# EAGLE design test-board (EAGLE 5.11)
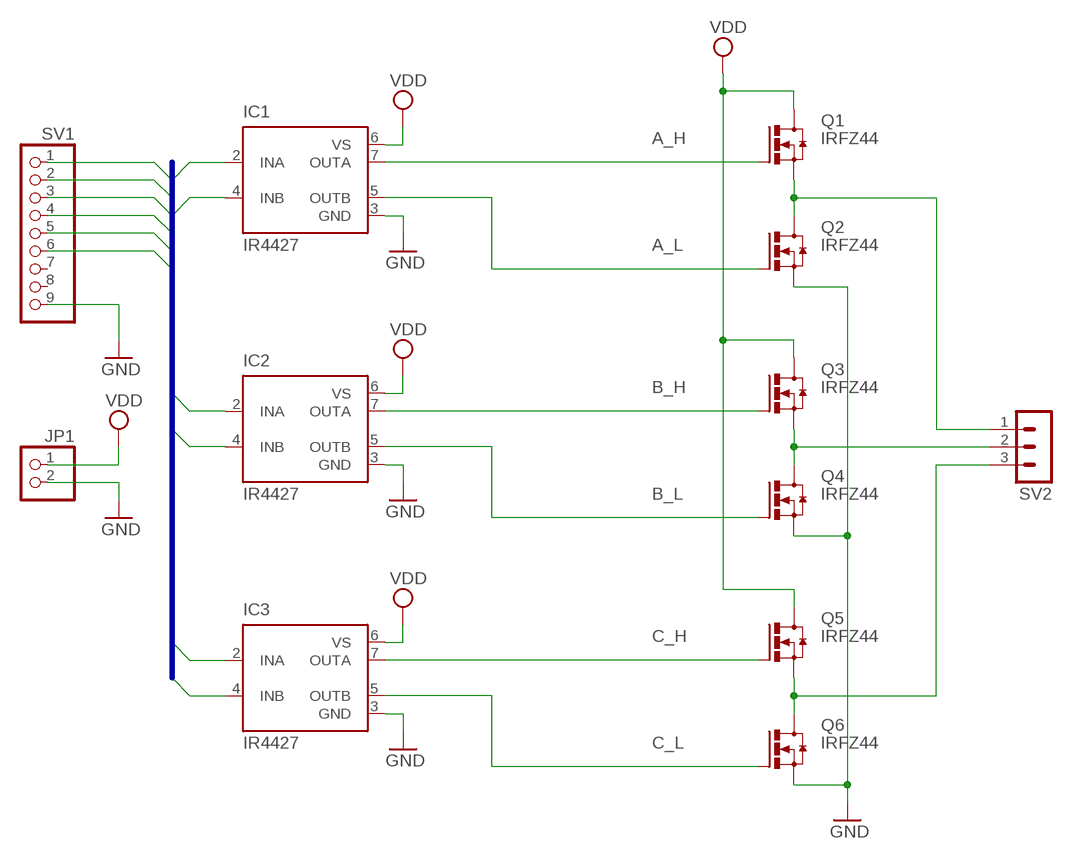
[diagram p0: schematic, sheet 1]

## Parts
IC1  IR4427  [DIL08]
IC2  IR4427  [DIL08]
IC3  IR4427  [DIL08]
JP1  PINHD-1X2  [1X02]
Q1  IRFZ44  [TO220BV]
Q2  IRFZ44  [TO220BV]
Q3  IRFZ44  [TO220BV]
Q4  IRFZ44  [TO220BV]
Q5  IRFZ44  [TO220BV]
Q6  IRFZ44  [TO220BV]
SV1  PINHD-1X9  [1X09]
SV2  MA03-1  [MA03-1]

## Nets
A: Q1.3(S) Q2.2(D) SV2.1
A_H: IC1.7(OUTA) Q1.1(G)
A_L: IC1.5(OUTB) Q2.1(G)
B: Q3.3(S) Q4.2(D) SV2.2
B_H: IC2.7(OUTA) Q3.1(G)
B_L: IC2.5(OUTB) Q4.1(G)
C: Q5.3(S) Q6.2(D) SV2.3
C_H: IC3.7(OUTA) Q5.1(G)
C_L: IC3.5(OUTB) Q6.1(G)
GND: IC1.3(GND) IC2.3(GND) IC3.3(GND) JP1.2 Q2.3(S) Q4.3(S) Q6.3(S) SV1.9
INPUT_A_H: IC1.2(INA) SV1.2
INPUT_A_L: IC1.4(INB) SV1.1
INPUT_B_H: IC2.2(INA) SV1.4
INPUT_B_L: IC2.4(INB) SV1.3
INPUT_C_H: IC3.2(INA) SV1.6
INPUT_C_L: IC3.4(INB) SV1.5
VDD: IC1.6(VS) IC2.6(VS) IC3.6(VS) JP1.1 Q1.2(D) Q3.2(D) Q5.2(D)
Unconnected: SV1.7 SV1.8

## Buses
INPUT_A_H,INPUT_A_L,INPUT_B_H,INPUT_B_L,INPUT_C_H,INPUT_C_L

## Library data of the parts
IC1-IC3 = ir:IR4427: DUAL LOW SIDE DRIVER Source: ID4426.pdf; MF: INTERNATIONAL RECTIFIER(IR); MPN: IR4427; OC_FARNELL: 1023267; OC_NEWARK: 27C6914
JP1 = pinhead:PINHD-1X2: PIN HEADER
Q1-Q6 = irf:IRFZ44: 50A, 60V, N-Channel Power MOSFET
SV1 = pinhead:PINHD-1X9: PIN HEADER
SV2 = con-lstb:MA03-1: PIN HEADER; OC_FARNELL: unknown; OC_NEWARK: unknown

## Board
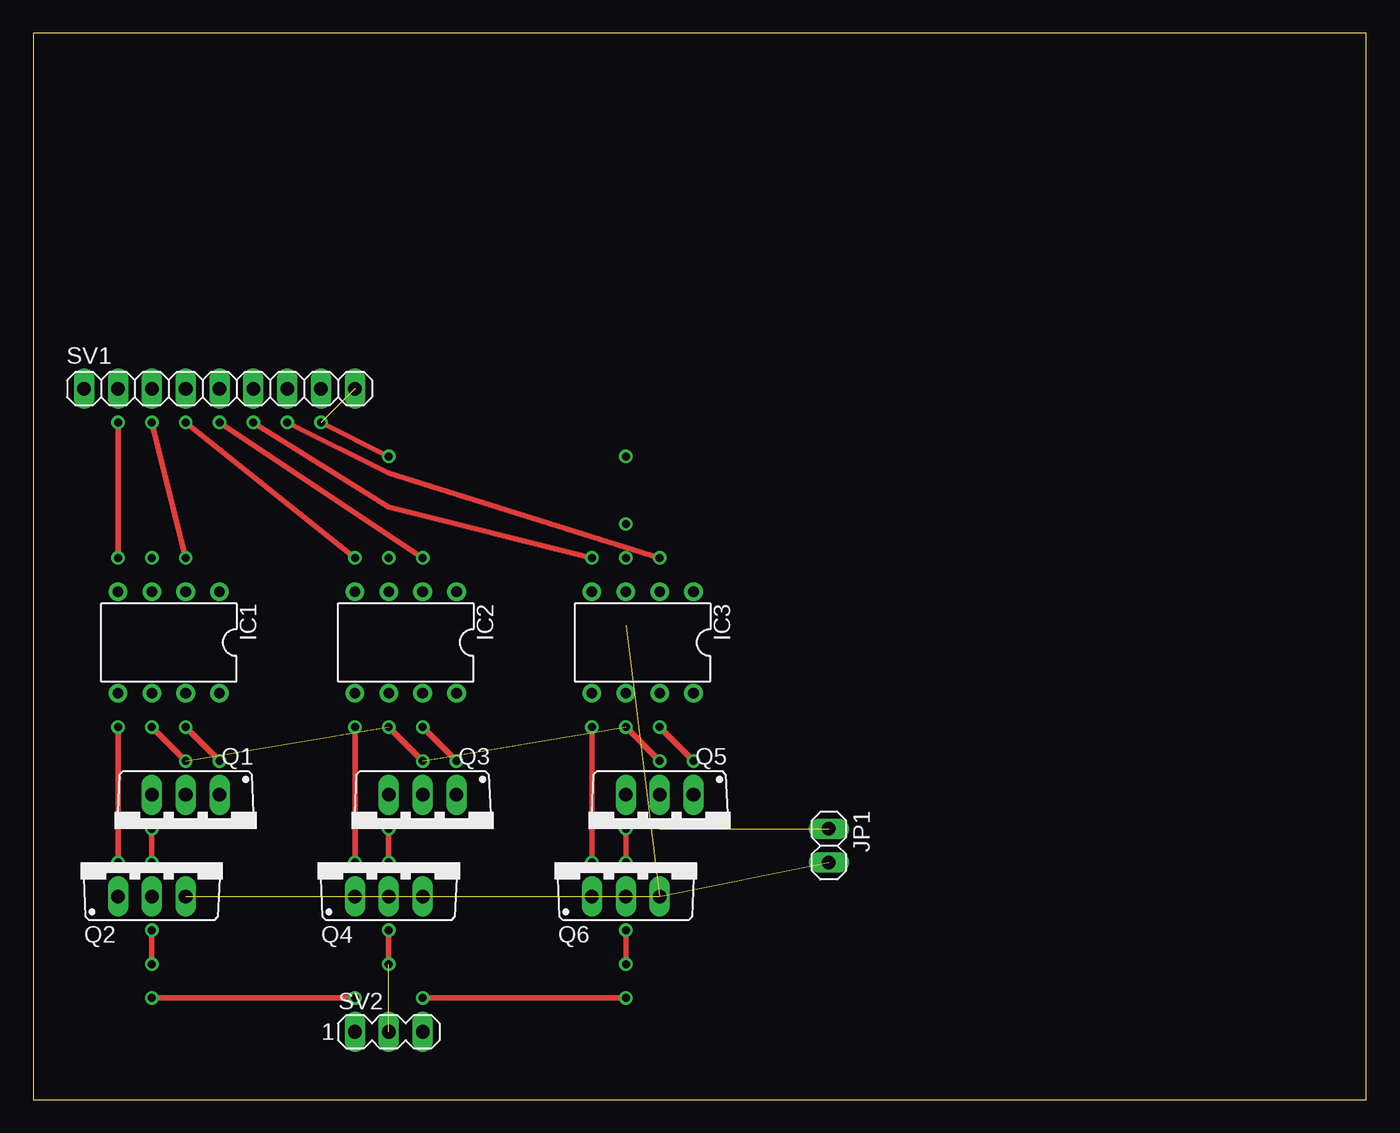
[diagram p1: board, top side]
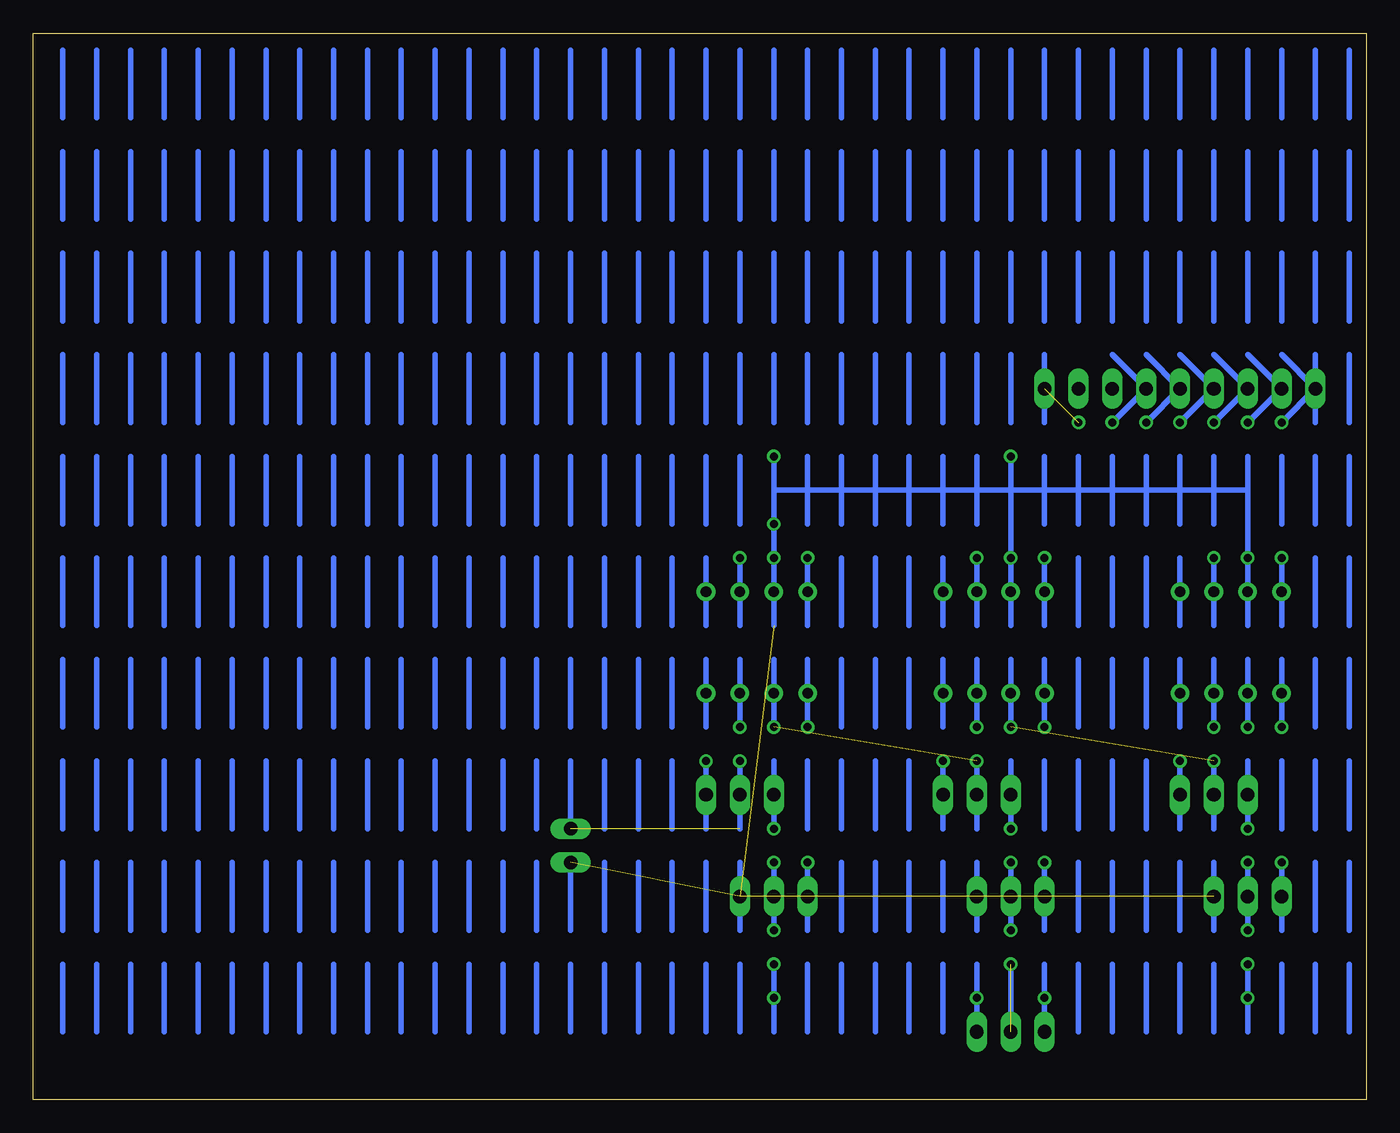
[diagram p2: board, bottom side, seen from below]

Size 100 x 80 mm. Coordinates in mm from the lower left corner, seen from the top.
Outline: 0,0 100,0 100,80 0,80 0,0
Copper layers (1*16): Top 0.035mm / dielectric 1.5mm / Bottom 0.035mm
Design rules "default": minimum track width 10mil, minimum drill 0.6mm, track to track 8mil, track to pad 8mil, pad to pad 8mil, via to via 8mil, smd to smd 8mil, copper to edge 40mil, drill to drill 8mil, minimum pad ring 10mil, minimum via ring 8mil, stop-mask expansion 4mil, vias tented up to drill 0mil, thermal gap 10mil

### Footprints (pad centres in the part's own frame; a part is rotated, then mirrored left to right if it is on the bottom)
DIL08 = drill 0.8 pad 1.4 round: 1 -3.81,-3.81; 2 -1.27,-3.81; 3 1.27,-3.81; 4 3.81,-3.81; 5 3.81,3.81; 6 1.27,3.81; 7 -1.27,3.81; 8 -3.81,3.81
1X02 = drill 1.016 long: 1 -1.27,0; 2 1.27,0
TO220BV = drill 1.016 long: 1 -2.54,-2.54; 2 0,-2.54; 3 2.54,-2.54
1X09 = drill 1.016 long: 1 -10.16,0; 2 -7.62,0; 3 -5.08,0; 4 -2.54,0; 5 0,0; 6 2.54,0; 7 5.08,0; 8 7.62,0; 9 10.16,0
MA03-1 = drill 1.016 long: 1 -2.54,0; 2 0,0; 3 2.54,0

### Placement (x,y rotation side)
IC1  10.16,34.29 180 top
IC2  27.94,34.29 180 top
IC3  45.72,34.29 180 top
JP1  59.69,19.05 270 top
Q1  11.43,20.32 180 top
Q2  8.89,17.78 0 top
Q3  29.21,20.32 180 top
Q4  26.67,17.78 0 top
Q5  46.99,20.32 180 top
Q6  44.45,17.78 0 top
SV1  13.97,53.34 0 top
SV2  26.67,5.08 0 top

### Tracks (layer width: path | path; a pad name or v marks a point on that pad's centre or on a via)
A  (via drill 0.6)
  Top 0.406: v8.89,17.78 v8.89,20.32 | v8.89,10.16 v8.89,12.7 | v8.89,7.62 v24.13,7.62
  Bottom 0.406: v8.89,20.32 Q1.3 8.89,25.4 | v8.89,12.7 Q2.2 v8.89,17.78 | 8.89,5.08 v8.89,7.62 v8.89,10.16 | SV2.1 v24.13,7.62 24.13,10.16
  other vias: 8.89,22.86 8.89,15.24
A_H  (via drill 0.6)
  Top 0.406: v13.97,25.4 v11.43,27.94
  Bottom 0.406: v11.43,27.94 IC1.7 11.43,33.02 | 13.97,20.32 Q1.1 v13.97,25.4
  other vias: 11.43,30.48 13.97,22.86
A_L  (via drill 0.6)
  Top 0.406: v6.35,17.78 v6.35,27.94
  Bottom 0.406: v6.35,27.94 IC1.5 6.35,33.02 | 6.35,12.7 Q2.1 v6.35,17.78
  other vias: 6.35,30.48 6.35,15.24
B  (via drill 0.6)  (1 unrouted)
  Top 0.406: 26.67,10.16 v26.67,12.7 | v26.67,17.78 v26.67,20.32
  Bottom 0.406: v26.67,17.78 Q4.2 v26.67,12.7 | v26.67,20.32 Q3.3 26.67,25.4
  other vias: 26.67,15.24 26.67,22.86
B_H  (via drill 0.6)
  Top 0.406: v31.75,25.4 v29.21,27.94
  Bottom 0.406: v29.21,27.94 IC2.7 29.21,33.02 | 31.75,20.32 Q3.1 v31.75,25.4
  other vias: 29.21,30.48 31.75,22.86
B_L  (via drill 0.6)
  Top 0.406: v24.13,17.78 v24.13,27.94
  Bottom 0.406: v24.13,27.94 IC2.5 24.13,33.02 | 24.13,12.7 Q4.1 v24.13,17.78
  other vias: 24.13,30.48 24.13,15.24
C  (via drill 0.6)
  Top 0.406: v44.45,17.78 v44.45,20.32 | v29.21,7.62 v44.45,7.62 | v44.45,10.16 v44.45,12.7
  Bottom 0.406: v44.45,20.32 Q5.3 44.45,25.4 | v44.45,12.7 Q6.2 v44.45,17.78 | SV2.3 v29.21,7.62 29.21,10.16 | 44.45,5.08 v44.45,7.62 v44.45,10.16
  other vias: 44.45,22.86 44.45,15.24
C_H  (via drill 0.6)
  Top 0.406: v49.53,25.4 v46.99,27.94
  Bottom 0.406: v46.99,27.94 IC3.7 46.99,33.02 | 49.53,20.32 Q5.1 v49.53,25.4
  other vias: 49.53,22.86 46.99,30.48
C_L  (via drill 0.6)
  Top 0.406: v41.91,17.78 v41.91,27.94
  Bottom 0.406: v41.91,27.94 IC3.5 41.91,33.02 | 41.91,12.7 Q6.1 v41.91,17.78
  other vias: 41.91,15.24 41.91,30.48
GND  (via drill 0.6)  (5 unrouted)
  Top 0.406: v26.67,48.26 v21.59,50.8
  Bottom 0.406: 8.89,35.56 IC1.3 v8.89,40.64 8.89,45.72 | 26.67,35.56 IC2.3 v26.67,40.64 26.67,45.72 | 44.45,35.56 IC3.3 v44.45,40.64 v44.45,43.18 44.45,45.72 | 26.67,45.72 v26.67,48.26 | 44.45,45.72 v44.45,48.26 | 8.89,45.72 8.89,48.26 | 8.89,45.72 11.43,45.72 | 11.43,45.72 13.97,45.72 | 13.97,45.72 16.51,45.72 | 16.51,45.72 19.05,45.72 | 19.05,45.72 21.59,45.72 | 21.59,45.72 24.13,45.72 | 24.13,45.72 26.67,45.72 | 11.43,45.72 11.43,48.26 | 13.97,45.72 13.97,48.26 | 16.51,45.72 16.51,48.26 | 19.05,45.72 19.05,48.26 | 21.59,45.72 21.59,48.26 | 24.13,45.72 24.13,48.26 | 24.13,45.72 24.13,43.18 | 21.59,45.72 21.59,43.18 | 19.05,45.72 19.05,43.18 | 16.51,45.72 16.51,43.18 | 13.97,45.72 13.97,43.18 | 11.43,45.72 11.43,43.18 | 29.21,45.72 29.21,43.18 | 29.21,45.72 29.21,48.26 | 26.67,45.72 29.21,45.72 | 31.75,45.72 31.75,43.18 | 31.75,45.72 31.75,48.26 | 29.21,45.72 31.75,45.72 | 34.29,45.72 34.29,43.18 | 34.29,45.72 34.29,48.26 | 31.75,45.72 34.29,45.72 | 36.83,45.72 36.83,43.18 | 36.83,45.72 36.83,48.26 | 34.29,45.72 36.83,45.72 | 39.37,45.72 39.37,43.18 | 39.37,45.72 39.37,48.26 | 36.83,45.72 39.37,45.72 | 41.91,45.72 41.91,43.18 | 41.91,45.72 41.91,48.26 | 39.37,45.72 41.91,45.72 | 41.91,45.72 44.45,45.72
  other vias: 8.89,38.1 26.67,38.1 44.45,38.1
INPUT_A_H  (via drill 0.6)
  Top 0.406: v11.43,40.64 v8.89,50.8
  Bottom 0.406: 11.43,35.56 IC1.2 v11.43,40.64 | v8.89,50.8 SV1.2 8.89,55.88
  other vias: 11.43,38.1 6.35,53.34
INPUT_A_L  (via drill 0.6)
  Top 0.406: v6.35,40.64 v6.35,50.8
  Bottom 0.406: 6.35,35.56 IC1.4 v6.35,40.64 | v6.35,50.8 SV1.1 6.35,55.88
  other vias: 6.35,38.1 3.81,53.34 3.81,53.34 3.81,53.34
INPUT_B_H  (via drill 0.6)
  Top 0.406: v13.97,50.8 v29.21,40.64
  Bottom 0.406: 29.21,35.56 IC2.2 v29.21,40.64 | v13.97,50.8 SV1.4 13.97,55.88
  other vias: 29.21,38.1 11.43,53.34
INPUT_B_L  (via drill 0.6)
  Top 0.406: v24.13,40.64 v11.43,50.8
  Bottom 0.406: 24.13,35.56 IC2.4 v24.13,40.64 | v11.43,50.8 SV1.3 11.43,55.88
  other vias: 24.13,38.1 8.89,53.34
INPUT_C_H  (via drill 0.6)
  Top 0.406: v19.05,50.8 26.67,46.99 v46.99,40.64
  Bottom 0.406: 46.99,35.56 IC3.2 v46.99,40.64 | v19.05,50.8 SV1.6 19.05,55.88
  other vias: 46.99,38.1 16.51,53.34
INPUT_C_L  (via drill 0.6)
  Top 0.406: v16.51,50.8 26.67,44.45 v41.91,40.64
  Bottom 0.406: 41.91,35.56 IC3.4 v41.91,40.64 | v16.51,50.8 SV1.5 16.51,55.88
  other vias: 41.91,38.1 13.97,53.34
N$1
  Bottom 0.406: 24.13,20.32 24.13,25.4
N$2
  Bottom 0.406: 1.27,73.66 1.27,78.74
N$3
  Bottom 0.406: 3.81,73.66 3.81,78.74
N$4
  Bottom 0.406: 6.35,43.18 6.35,48.26
N$5
  Bottom 0.406: 6.35,73.66 6.35,78.74
N$6
  Bottom 0.406: 8.89,73.66 8.89,78.74
N$7
  Bottom 0.406: 11.43,73.66 11.43,78.74
N$8
  Bottom 0.406: 13.97,73.66 13.97,78.74
N$10
  Bottom 0.406: 16.51,73.66 16.51,78.74
N$11
  Bottom 0.406: 19.05,73.66 19.05,78.74
N$12
  Bottom 0.406: 21.59,73.66 21.59,78.74
N$13
  Bottom 0.406: 24.13,73.66 24.13,78.74
N$14
  Bottom 0.406: 26.67,73.66 26.67,78.74
N$15
  Bottom 0.406: 29.21,73.66 29.21,78.74
N$16
  Bottom 0.406: 31.75,73.66 31.75,78.74
N$17
  Bottom 0.406: 34.29,73.66 34.29,78.74
N$18
  Bottom 0.406: 36.83,73.66 36.83,78.74
N$19
  Bottom 0.406: 39.37,73.66 39.37,78.74
N$20
  Bottom 0.406: 41.91,73.66 41.91,78.74
N$21
  Bottom 0.406: 44.45,73.66 44.45,78.74
N$22
  Bottom 0.406: 46.99,73.66 46.99,78.74
N$23
  Bottom 0.406: 49.53,73.66 49.53,78.74
N$24
  Bottom 0.406: 52.07,73.66 52.07,78.74
N$25
  Bottom 0.406: 54.61,73.66 54.61,78.74
N$26
  Bottom 0.406: 57.15,73.66 57.15,78.74
N$27
  Bottom 0.406: 59.69,73.66 59.69,78.74
N$28
  Bottom 0.406: 62.23,73.66 62.23,78.74
N$29
  Bottom 0.406: 64.77,73.66 64.77,78.74
N$30
  Bottom 0.406: 67.31,73.66 67.31,78.74
N$31
  Bottom 0.406: 69.85,73.66 69.85,78.74
N$32
  Bottom 0.406: 72.39,73.66 72.39,78.74
N$33
  Bottom 0.406: 74.93,73.66 74.93,78.74
N$34
  Bottom 0.406: 77.47,73.66 77.47,78.74
N$35
  Bottom 0.406: 80.01,73.66 80.01,78.74
N$36
  Bottom 0.406: 82.55,73.66 82.55,78.74
N$37
  Bottom 0.406: 85.09,73.66 85.09,78.74
N$38
  Bottom 0.406: 87.63,73.66 87.63,78.74
N$39
  Bottom 0.406: 90.17,73.66 90.17,78.74
N$40
  Bottom 0.406: 92.71,73.66 92.71,78.74
N$41
  Bottom 0.406: 95.25,73.66 95.25,78.74
N$42
  Bottom 0.406: 97.79,73.66 97.79,78.74
N$43
  Bottom 0.406: 1.27,66.04 1.27,71.12
N$44
  Bottom 0.406: 3.81,66.04 3.81,71.12
N$45
  Bottom 0.406: 6.35,66.04 6.35,71.12
N$46
  Bottom 0.406: 8.89,66.04 8.89,71.12
N$47
  Bottom 0.406: 11.43,66.04 11.43,71.12
N$48
  Bottom 0.406: 13.97,66.04 13.97,71.12
N$49
  Bottom 0.406: 16.51,66.04 16.51,71.12
N$50
  Bottom 0.406: 19.05,66.04 19.05,71.12
N$51
  Bottom 0.406: 21.59,66.04 21.59,71.12
N$52
  Bottom 0.406: 24.13,66.04 24.13,71.12
N$53
  Bottom 0.406: 26.67,66.04 26.67,71.12
N$54
  Bottom 0.406: 29.21,66.04 29.21,71.12
N$55
  Bottom 0.406: 31.75,66.04 31.75,71.12
N$56
  Bottom 0.406: 34.29,66.04 34.29,71.12
N$57
  Bottom 0.406: 36.83,66.04 36.83,71.12
N$58
  Bottom 0.406: 39.37,66.04 39.37,71.12
N$59
  Bottom 0.406: 41.91,66.04 41.91,71.12
N$60
  Bottom 0.406: 44.45,66.04 44.45,71.12
N$61
  Bottom 0.406: 46.99,66.04 46.99,71.12
N$62
  Bottom 0.406: 49.53,66.04 49.53,71.12
N$63
  Bottom 0.406: 52.07,66.04 52.07,71.12
N$64
  Bottom 0.406: 54.61,66.04 54.61,71.12
N$65
  Bottom 0.406: 57.15,66.04 57.15,71.12
N$66
  Bottom 0.406: 59.69,66.04 59.69,71.12
N$67
  Bottom 0.406: 62.23,66.04 62.23,71.12
N$68
  Bottom 0.406: 64.77,66.04 64.77,71.12
N$69
  Bottom 0.406: 67.31,66.04 67.31,71.12
N$70
  Bottom 0.406: 69.85,66.04 69.85,71.12
N$71
  Bottom 0.406: 72.39,66.04 72.39,71.12
N$72
  Bottom 0.406: 74.93,66.04 74.93,71.12
N$73
  Bottom 0.406: 77.47,66.04 77.47,71.12
N$74
  Bottom 0.406: 80.01,66.04 80.01,71.12
N$75
  Bottom 0.406: 82.55,66.04 82.55,71.12
N$76
  Bottom 0.406: 85.09,66.04 85.09,71.12
N$77
  Bottom 0.406: 87.63,66.04 87.63,71.12
N$78
  Bottom 0.406: 90.17,66.04 90.17,71.12
N$79
  Bottom 0.406: 92.71,66.04 92.71,71.12
N$80
  Bottom 0.406: 95.25,66.04 95.25,71.12
N$81
  Bottom 0.406: 97.79,66.04 97.79,71.12
N$82
  Bottom 0.406: 1.27,58.42 1.27,63.5
N$83
  Bottom 0.406: 3.81,58.42 3.81,63.5
N$84
  Bottom 0.406: 6.35,58.42 6.35,63.5
N$85
  Bottom 0.406: 8.89,58.42 8.89,63.5
N$86
  Bottom 0.406: 11.43,58.42 11.43,63.5
N$87
  Bottom 0.406: 13.97,58.42 13.97,63.5
N$88
  Bottom 0.406: 16.51,58.42 16.51,63.5
N$89
  Bottom 0.406: 19.05,58.42 19.05,63.5
N$90
  Bottom 0.406: 21.59,58.42 21.59,63.5
N$91
  Bottom 0.406: 24.13,58.42 24.13,63.5
N$92
  Bottom 0.406: 26.67,58.42 26.67,63.5
N$93
  Bottom 0.406: 29.21,58.42 29.21,63.5
N$94
  Bottom 0.406: 31.75,58.42 31.75,63.5
N$95
  Bottom 0.406: 34.29,58.42 34.29,63.5
N$96
  Bottom 0.406: 36.83,58.42 36.83,63.5
N$97
  Bottom 0.406: 39.37,58.42 39.37,63.5
N$98
  Bottom 0.406: 41.91,58.42 41.91,63.5
N$99
  Bottom 0.406: 44.45,58.42 44.45,63.5
N$100
  Bottom 0.406: 46.99,58.42 46.99,63.5
N$101
  Bottom 0.406: 49.53,58.42 49.53,63.5
N$102
  Bottom 0.406: 52.07,58.42 52.07,63.5
N$103
  Bottom 0.406: 54.61,58.42 54.61,63.5
N$104
  Bottom 0.406: 57.15,58.42 57.15,63.5
N$105
  Bottom 0.406: 59.69,58.42 59.69,63.5
N$106
  Bottom 0.406: 62.23,58.42 62.23,63.5
N$107
  Bottom 0.406: 64.77,58.42 64.77,63.5
N$108
  Bottom 0.406: 67.31,58.42 67.31,63.5
N$109
  Bottom 0.406: 69.85,58.42 69.85,63.5
N$110
  Bottom 0.406: 72.39,58.42 72.39,63.5
N$111
  Bottom 0.406: 74.93,58.42 74.93,63.5
N$112
  Bottom 0.406: 77.47,58.42 77.47,63.5
N$113
  Bottom 0.406: 80.01,58.42 80.01,63.5
N$114
  Bottom 0.406: 82.55,58.42 82.55,63.5
N$115
  Bottom 0.406: 85.09,58.42 85.09,63.5
N$116
  Bottom 0.406: 87.63,58.42 87.63,63.5
N$117
  Bottom 0.406: 90.17,58.42 90.17,63.5
N$118
  Bottom 0.406: 92.71,58.42 92.71,63.5
N$119
  Bottom 0.406: 95.25,58.42 95.25,63.5
N$120
  Bottom 0.406: 97.79,58.42 97.79,63.5
N$121
  Bottom 0.406: 1.27,50.8 1.27,55.88
N$122
  Bottom 0.406: 3.81,50.8 3.81,55.88
N$130
  Bottom 0.406: 24.13,50.8 24.13,55.88
N$131
  Bottom 0.406: 26.67,50.8 26.67,55.88
N$132
  Bottom 0.406: 29.21,50.8 29.21,55.88
N$133
  Bottom 0.406: 31.75,50.8 31.75,55.88
N$134
  Bottom 0.406: 34.29,50.8 34.29,55.88
N$135
  Bottom 0.406: 36.83,50.8 36.83,55.88
N$136
  Bottom 0.406: 39.37,50.8 39.37,55.88
N$137
  Bottom 0.406: 41.91,50.8 41.91,55.88
N$138
  Bottom 0.406: 44.45,50.8 44.45,55.88
N$139
  Bottom 0.406: 46.99,50.8 46.99,55.88
N$140
  Bottom 0.406: 49.53,50.8 49.53,55.88
N$141
  Bottom 0.406: 52.07,50.8 52.07,55.88
N$142
  Bottom 0.406: 54.61,50.8 54.61,55.88
N$143
  Bottom 0.406: 57.15,50.8 57.15,55.88
N$144
  Bottom 0.406: 59.69,50.8 59.69,55.88
N$145
  Bottom 0.406: 62.23,50.8 62.23,55.88
N$146
  Bottom 0.406: 64.77,50.8 64.77,55.88
N$147
  Bottom 0.406: 67.31,50.8 67.31,55.88
N$148
  Bottom 0.406: 69.85,50.8 69.85,55.88
N$149
  Bottom 0.406: 72.39,50.8 72.39,55.88
N$150
  Bottom 0.406: 74.93,50.8 74.93,55.88
N$151
  Bottom 0.406: 77.47,50.8 77.47,55.88
N$152
  Bottom 0.406: 80.01,50.8 80.01,55.88
N$153
  Bottom 0.406: 82.55,50.8 82.55,55.88
N$154
  Bottom 0.406: 85.09,50.8 85.09,55.88
N$155
  Bottom 0.406: 87.63,50.8 87.63,55.88
N$156
  Bottom 0.406: 90.17,50.8 90.17,55.88
N$157
  Bottom 0.406: 92.71,50.8 92.71,55.88
N$158
  Bottom 0.406: 95.25,50.8 95.25,55.88
N$159
  Bottom 0.406: 97.79,50.8 97.79,55.88
N$160
  Bottom 0.406: 1.27,43.18 1.27,48.26
N$161
  Bottom 0.406: 3.81,43.18 3.81,48.26
N$178
  Bottom 0.406: 46.99,43.18 46.99,48.26
N$179
  Bottom 0.406: 49.53,43.18 49.53,48.26
N$180
  Bottom 0.406: 52.07,43.18 52.07,48.26
N$181
  Bottom 0.406: 54.61,43.18 54.61,48.26
N$182
  Bottom 0.406: 57.15,43.18 57.15,48.26
N$183
  Bottom 0.406: 59.69,43.18 59.69,48.26
N$184
  Bottom 0.406: 62.23,43.18 62.23,48.26
N$185
  Bottom 0.406: 64.77,43.18 64.77,48.26
N$186
  Bottom 0.406: 67.31,43.18 67.31,48.26
N$187
  Bottom 0.406: 69.85,43.18 69.85,48.26
N$188
  Bottom 0.406: 72.39,43.18 72.39,48.26
N$189
  Bottom 0.406: 74.93,43.18 74.93,48.26
N$190
  Bottom 0.406: 77.47,43.18 77.47,48.26
N$191
  Bottom 0.406: 80.01,43.18 80.01,48.26
N$192
  Bottom 0.406: 82.55,43.18 82.55,48.26
N$193
  Bottom 0.406: 85.09,43.18 85.09,48.26
N$194
  Bottom 0.406: 87.63,43.18 87.63,48.26
N$195
  Bottom 0.406: 90.17,43.18 90.17,48.26
N$196
  Bottom 0.406: 92.71,43.18 92.71,48.26
N$197
  Bottom 0.406: 95.25,43.18 95.25,48.26
N$198
  Bottom 0.406: 97.79,43.18 97.79,48.26
N$199
  Bottom 0.406: 1.27,35.56 1.27,40.64
N$200
  Bottom 0.406: 3.81,35.56 3.81,40.64
N$204  (via drill 0.6)
  Bottom 0.406: 13.97,35.56 v13.97,38.1 13.97,40.64
N$205
  Bottom 0.406: 16.51,35.56 16.51,40.64
N$206
  Bottom 0.406: 19.05,35.56 19.05,40.64
N$207
  Bottom 0.406: 21.59,35.56 21.59,40.64
N$211  (via drill 0.6)
  Bottom 0.406: 31.75,35.56 v31.75,38.1 31.75,40.64
N$212
  Bottom 0.406: 34.29,35.56 34.29,40.64
N$213
  Bottom 0.406: 36.83,35.56 36.83,40.64
N$214
  Bottom 0.406: 39.37,35.56 39.37,40.64
N$218  (via drill 0.6)
  Bottom 0.406: 49.53,35.56 v49.53,38.1 49.53,40.64
N$219
  Bottom 0.406: 52.07,35.56 52.07,40.64
N$220
  Bottom 0.406: 54.61,35.56 54.61,40.64
N$221
  Bottom 0.406: 57.15,35.56 57.15,40.64
N$222
  Bottom 0.406: 59.69,35.56 59.69,40.64
N$223
  Bottom 0.406: 62.23,35.56 62.23,40.64
N$224
  Bottom 0.406: 64.77,35.56 64.77,40.64
N$225
  Bottom 0.406: 67.31,35.56 67.31,40.64
N$226
  Bottom 0.406: 69.85,35.56 69.85,40.64
N$227
  Bottom 0.406: 72.39,35.56 72.39,40.64
N$228
  Bottom 0.406: 74.93,35.56 74.93,40.64
N$229
  Bottom 0.406: 77.47,35.56 77.47,40.64
N$230
  Bottom 0.406: 80.01,35.56 80.01,40.64
N$231
  Bottom 0.406: 82.55,35.56 82.55,40.64
N$232
  Bottom 0.406: 85.09,35.56 85.09,40.64
N$233
  Bottom 0.406: 87.63,35.56 87.63,40.64
N$234
  Bottom 0.406: 90.17,35.56 90.17,40.64
N$235
  Bottom 0.406: 92.71,35.56 92.71,40.64
N$236
  Bottom 0.406: 95.25,35.56 95.25,40.64
N$237
  Bottom 0.406: 97.79,35.56 97.79,40.64
N$238
  Bottom 0.406: 1.27,27.94 1.27,33.02
N$239
  Bottom 0.406: 3.81,27.94 3.81,33.02
N$243  (via drill 0.6)
  Bottom 0.406: 13.97,27.94 v13.97,30.48 13.97,33.02
N$244
  Bottom 0.406: 16.51,27.94 16.51,33.02
N$245
  Bottom 0.406: 19.05,27.94 19.05,33.02
N$246
  Bottom 0.406: 21.59,27.94 21.59,33.02
N$250  (via drill 0.6)
  Bottom 0.406: 31.75,27.94 v31.75,30.48 31.75,33.02
N$251
  Bottom 0.406: 34.29,27.94 34.29,33.02
N$252
  Bottom 0.406: 36.83,27.94 36.83,33.02
N$253
  Bottom 0.406: 39.37,27.94 39.37,33.02
N$257  (via drill 0.6)
  Bottom 0.406: 49.53,27.94 v49.53,30.48 49.53,33.02
N$258
  Bottom 0.406: 52.07,27.94 52.07,33.02
N$259
  Bottom 0.406: 54.61,27.94 54.61,33.02
N$260
  Bottom 0.406: 57.15,27.94 57.15,33.02
N$261
  Bottom 0.406: 59.69,27.94 59.69,33.02
N$262
  Bottom 0.406: 62.23,27.94 62.23,33.02
N$263
  Bottom 0.406: 64.77,27.94 64.77,33.02
N$264
  Bottom 0.406: 67.31,27.94 67.31,33.02
N$265
  Bottom 0.406: 69.85,27.94 69.85,33.02
N$266
  Bottom 0.406: 72.39,27.94 72.39,33.02
N$267
  Bottom 0.406: 74.93,27.94 74.93,33.02
N$268
  Bottom 0.406: 77.47,27.94 77.47,33.02
N$269
  Bottom 0.406: 80.01,27.94 80.01,33.02
N$270
  Bottom 0.406: 82.55,27.94 82.55,33.02
N$271
  Bottom 0.406: 85.09,27.94 85.09,33.02
N$272
  Bottom 0.406: 87.63,27.94 87.63,33.02
N$273
  Bottom 0.406: 90.17,27.94 90.17,33.02
N$274
  Bottom 0.406: 92.71,27.94 92.71,33.02
N$275
  Bottom 0.406: 95.25,27.94 95.25,33.02
N$276
  Bottom 0.406: 97.79,27.94 97.79,33.02
N$277
  Bottom 0.406: 1.27,20.32 1.27,25.4
N$278
  Bottom 0.406: 3.81,20.32 3.81,25.4
N$279
  Bottom 0.406: 6.35,20.32 6.35,25.4
N$283
  Bottom 0.406: 16.51,20.32 16.51,25.4
N$284
  Bottom 0.406: 19.05,20.32 19.05,25.4
N$285
  Bottom 0.406: 21.59,20.32 21.59,25.4
N$290
  Bottom 0.406: 34.29,20.32 34.29,25.4
N$291
  Bottom 0.406: 36.83,20.32 36.83,25.4
N$292
  Bottom 0.406: 39.37,20.32 39.37,25.4
N$293
  Bottom 0.406: 41.91,20.32 41.91,25.4
N$297
  Bottom 0.406: 52.07,20.32 52.07,25.4
N$298
  Bottom 0.406: 54.61,20.32 54.61,25.4
N$299
  Bottom 0.406: 57.15,20.32 57.15,25.4
N$300  (via drill 0.6)
  Bottom 0.406: v59.69,20.32 59.69,25.4
N$301
  Bottom 0.406: 62.23,20.32 62.23,25.4
N$302
  Bottom 0.406: 64.77,20.32 64.77,25.4
N$303
  Bottom 0.406: 67.31,20.32 67.31,25.4
N$304
  Bottom 0.406: 69.85,20.32 69.85,25.4
N$305
  Bottom 0.406: 72.39,20.32 72.39,25.4
N$306
  Bottom 0.406: 74.93,20.32 74.93,25.4
N$307
  Bottom 0.406: 77.47,20.32 77.47,25.4
N$308
  Bottom 0.406: 80.01,20.32 80.01,25.4
N$309
  Bottom 0.406: 82.55,20.32 82.55,25.4
N$310
  Bottom 0.406: 85.09,20.32 85.09,25.4
N$311
  Bottom 0.406: 87.63,20.32 87.63,25.4
N$312
  Bottom 0.406: 90.17,20.32 90.17,25.4
N$313
  Bottom 0.406: 92.71,20.32 92.71,25.4
N$314
  Bottom 0.406: 95.25,20.32 95.25,25.4
N$315
  Bottom 0.406: 97.79,20.32 97.79,25.4
N$316
  Bottom 0.406: 1.27,12.7 1.27,17.78
N$317
  Bottom 0.406: 3.81,12.7 3.81,17.78
N$320  (via drill 0.6)
  Bottom 0.406: 11.43,12.7 v11.43,15.24 11.43,17.78
N$321
  Bottom 0.406: 13.97,12.7 13.97,17.78
N$322
  Bottom 0.406: 16.51,12.7 16.51,17.78
N$323
  Bottom 0.406: 19.05,12.7 19.05,17.78
N$324
  Bottom 0.406: 21.59,12.7 21.59,17.78
N$327  (via drill 0.6)
  Bottom 0.406: 29.21,12.7 v29.21,15.24 29.21,17.78
N$328
  Bottom 0.406: 31.75,12.7 31.75,17.78
N$329
  Bottom 0.406: 34.29,12.7 34.29,17.78
N$330
  Bottom 0.406: 36.83,12.7 36.83,17.78
N$331
  Bottom 0.406: 39.37,12.7 39.37,17.78
N$334  (via drill 0.6)
  Bottom 0.406: 46.99,12.7 v46.99,15.24 46.99,17.78
N$335
  Bottom 0.406: 49.53,12.7 49.53,17.78
N$336
  Bottom 0.406: 52.07,12.7 52.07,17.78
N$337
  Bottom 0.406: 54.61,12.7 54.61,17.78
N$338
  Bottom 0.406: 57.15,12.7 57.15,17.78
N$339  (via drill 0.6)
  Bottom 0.406: 59.69,12.7 v59.69,17.78
N$340
  Bottom 0.406: 62.23,12.7 62.23,17.78
N$341
  Bottom 0.406: 64.77,12.7 64.77,17.78
N$342
  Bottom 0.406: 67.31,12.7 67.31,17.78
N$343
  Bottom 0.406: 69.85,12.7 69.85,17.78
N$344
  Bottom 0.406: 72.39,12.7 72.39,17.78
N$345
  Bottom 0.406: 74.93,12.7 74.93,17.78
N$346
  Bottom 0.406: 77.47,12.7 77.47,17.78
N$347
  Bottom 0.406: 80.01,12.7 80.01,17.78
N$348
  Bottom 0.406: 82.55,12.7 82.55,17.78
N$349
  Bottom 0.406: 85.09,12.7 85.09,17.78
N$350
  Bottom 0.406: 87.63,12.7 87.63,17.78
N$351
  Bottom 0.406: 90.17,12.7 90.17,17.78
N$352
  Bottom 0.406: 92.71,12.7 92.71,17.78
N$353
  Bottom 0.406: 95.25,12.7 95.25,17.78
N$354
  Bottom 0.406: 97.79,12.7 97.79,17.78
N$355
  Bottom 0.406: 1.27,5.08 1.27,10.16
N$356
  Bottom 0.406: 3.81,5.08 3.81,10.16
N$357
  Bottom 0.406: 6.35,5.08 6.35,10.16
N$359
  Bottom 0.406: 11.43,5.08 11.43,10.16
N$360
  Bottom 0.406: 13.97,5.08 13.97,10.16
N$361
  Bottom 0.406: 16.51,5.08 16.51,10.16
N$362
  Bottom 0.406: 19.05,5.08 19.05,10.16
N$363
  Bottom 0.406: 21.59,5.08 21.59,10.16
N$365  (via drill 0.6)
  Bottom 0.406: 26.67,5.08 v26.67,10.16
N$367
  Bottom 0.406: 31.75,5.08 31.75,10.16
N$368
  Bottom 0.406: 34.29,5.08 34.29,10.16
N$369
  Bottom 0.406: 36.83,5.08 36.83,10.16
N$370
  Bottom 0.406: 39.37,5.08 39.37,10.16
N$371
  Bottom 0.406: 41.91,5.08 41.91,10.16
N$373
  Bottom 0.406: 46.99,5.08 46.99,10.16
N$374
  Bottom 0.406: 49.53,5.08 49.53,10.16
N$375
  Bottom 0.406: 52.07,5.08 52.07,10.16
N$376
  Bottom 0.406: 54.61,5.08 54.61,10.16
N$377
  Bottom 0.406: 57.15,5.08 57.15,10.16
N$378
  Bottom 0.406: 59.69,5.08 59.69,10.16
N$379
  Bottom 0.406: 62.23,5.08 62.23,10.16
N$380
  Bottom 0.406: 64.77,5.08 64.77,10.16
N$381
  Bottom 0.406: 67.31,5.08 67.31,10.16
N$382
  Bottom 0.406: 69.85,5.08 69.85,10.16
N$383
  Bottom 0.406: 72.39,5.08 72.39,10.16
N$384
  Bottom 0.406: 74.93,5.08 74.93,10.16
N$385
  Bottom 0.406: 77.47,5.08 77.47,10.16
N$386
  Bottom 0.406: 80.01,5.08 80.01,10.16
N$387
  Bottom 0.406: 82.55,5.08 82.55,10.16
N$388
  Bottom 0.406: 85.09,5.08 85.09,10.16
N$389
  Bottom 0.406: 87.63,5.08 87.63,10.16
N$390
  Bottom 0.406: 90.17,5.08 90.17,10.16
N$391
  Bottom 0.406: 92.71,5.08 92.71,10.16
N$392
  Bottom 0.406: 95.25,5.08 95.25,10.16
N$393
  Bottom 0.406: 97.79,5.08 97.79,10.16
VDD  (via drill 0.6)  (3 unrouted)
  Top 0.406: v11.43,25.4 v8.89,27.94 | v29.21,25.4 v26.67,27.94 | v46.99,25.4 v44.45,27.94
  Bottom 0.406: v8.89,27.94 IC1.6 8.89,33.02 | 11.43,20.32 Q1.2 v11.43,25.4 | v26.67,27.94 IC2.6 26.67,33.02 | 29.21,20.32 Q3.2 v29.21,25.4 | v44.45,27.94 IC3.6 44.45,33.02 | 46.99,20.32 Q5.2 v46.99,25.4
  other vias: 8.89,30.48 11.43,22.86 26.67,30.48 29.21,22.86 46.99,22.86 44.45,30.48